# EAGLE design IntUltiMem_proto2 (EAGLE 7.7.0)
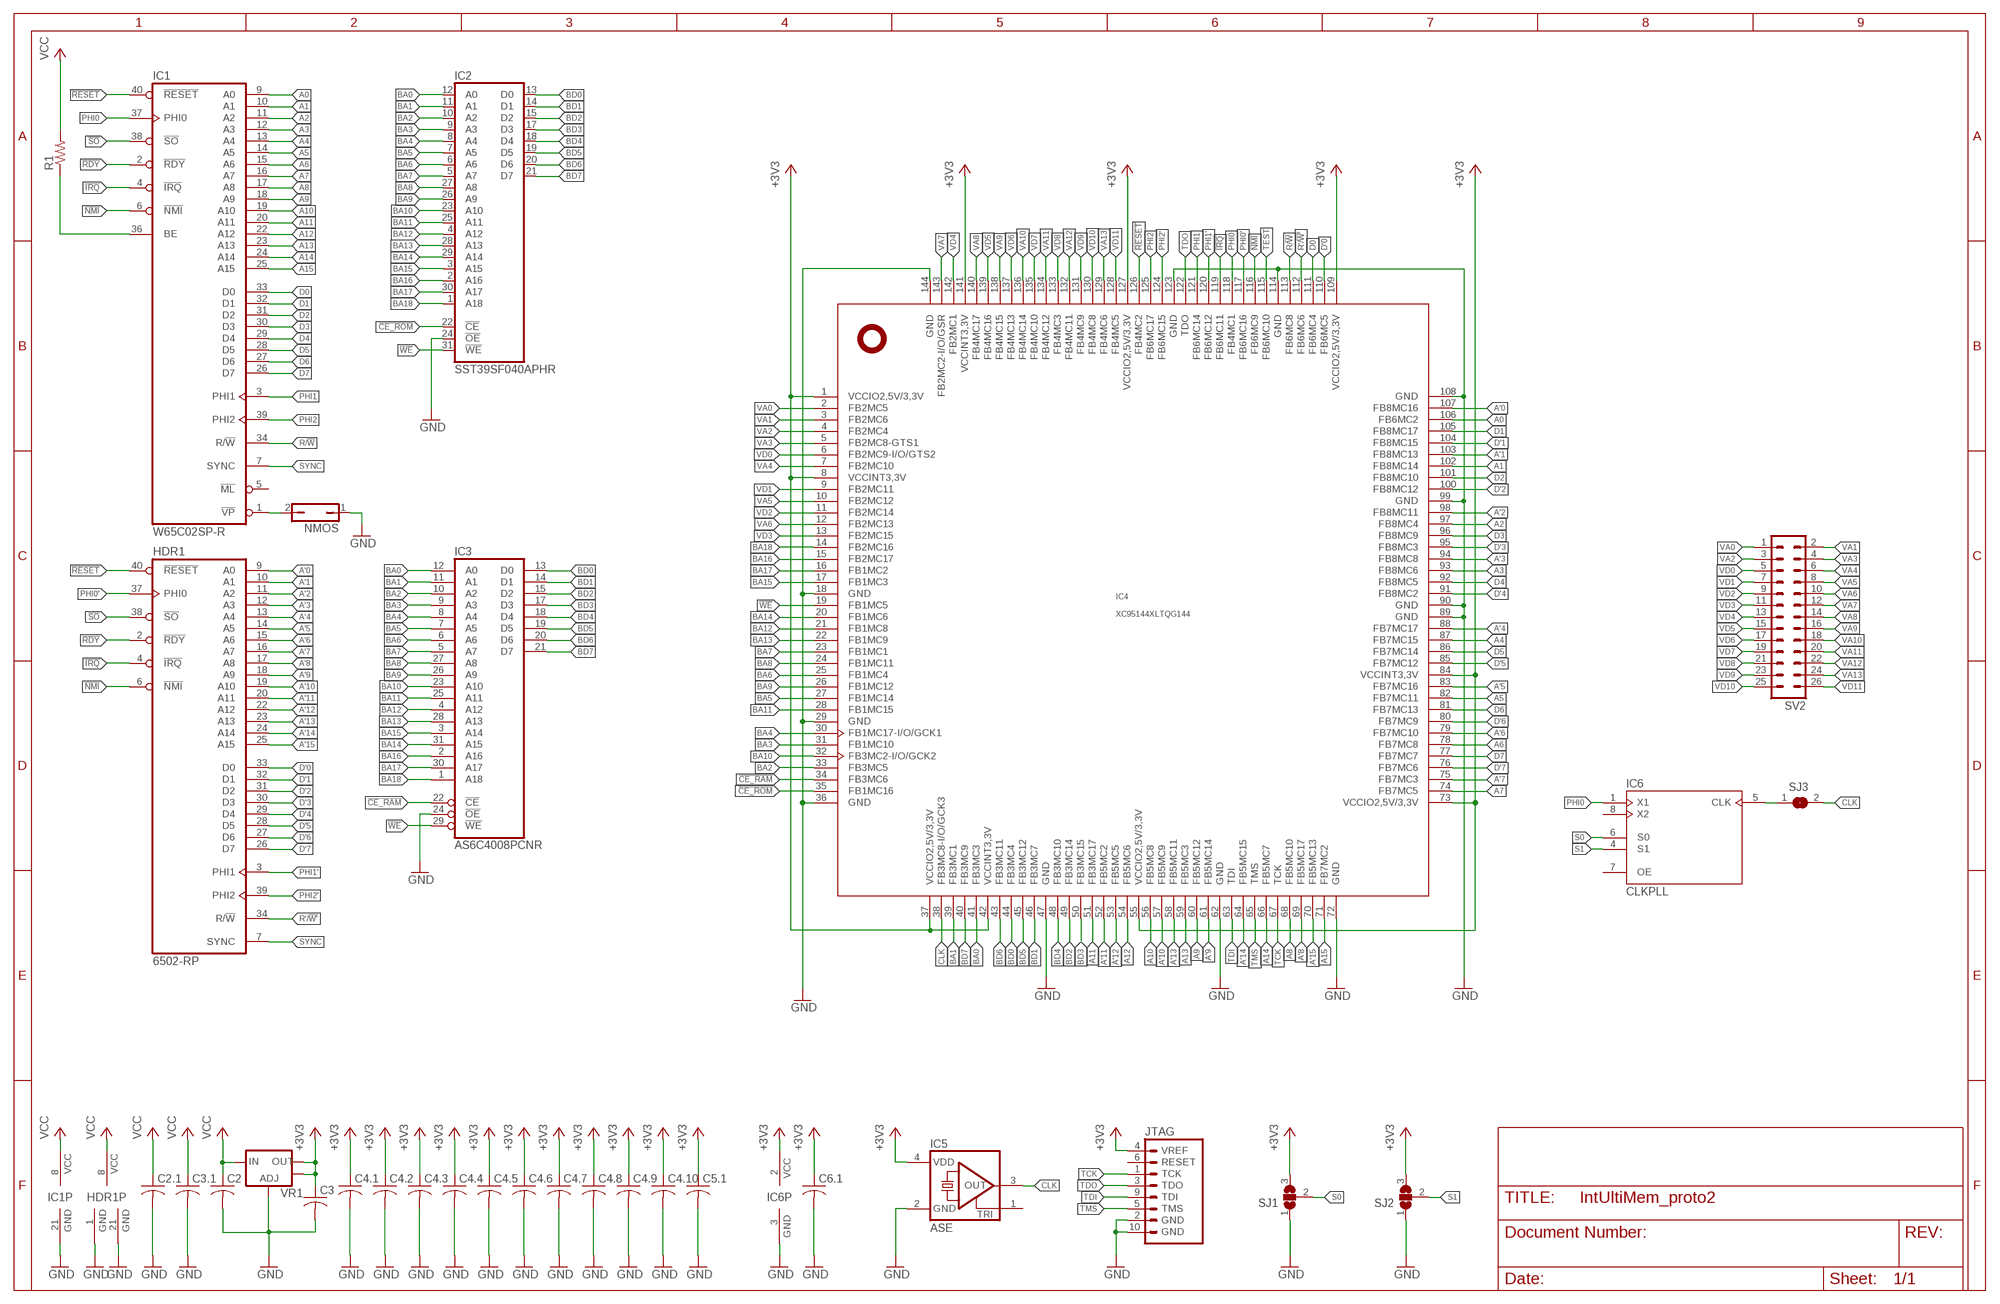
[diagram p0: schematic, sheet 1]

## Parts
C2  C-USC0805  [C0805]
C2.1  C-USC0402  [C0402]
C3  C-USC0805  [C0805]
C3.1  C-USC0402  [C0402]
C4.1  C-USC0402  [C0402]
C4.2  C-USC0402  [C0402]
C4.3  C-USC0402  [C0402]
C4.4  C-USC0402  [C0402]
C4.5  C-USC0402  [C0402]
C4.6  C-USC0402  [C0402]
C4.7  C-USC0402  [C0402]
C4.8  C-USC0402  [C0402]
C4.9  C-USC0402  [C0402]
C4.10  C-USC0402  [C0402]
C5.1  C-USC0402  [C0402]
C6.1  C-USC0402  [C0402]
HDR1  6502-RP  [DIL40-ROUNDPAD]
IC1  W65C02SP-R  [DIL40-ROUNDPAD]
IC2  SST39SF040APHR  [DIL32-RP]
IC3  AS6C4008PCNR  [DIL32-RP]
IC4  XC95144XLTQG144  [TQFP144]
IC5  ASE  [ASE]
IC6  CLKPLL  [SOIC8]
JTAG  JTAG  [JTAG]
NMOS  JP1Q  [JP1]
R1  R-US_R0402  [R0402]
SJ1  SJ2W  [SJ_2]
SJ2  SJ2W  [SJ_2]
SJ3  SJ  [SJ]
SV2  MA13-2  [MA13-2]
VR1  V_REG_LM1117SOT223  [SOT223]

## Nets
!CE_RAM: IC3.22(!CE) IC4.34(FB3MC6)
!CE_ROM: IC2.22(!CE) IC4.35(FB1MC16)
!IRQ: HDR1.4(!IRQ) IC1.4(!IRQ) IC4.119(FB6MC11)
!NMI: HDR1.6(!NMI) IC1.6(!NMI) IC4.116(FB6MC9)
!RDY: HDR1.2(!RDY) IC1.2(!RDY)
!RESET: HDR1.40(!RESET) IC1.40(!RESET) IC4.126(FB4MC2)
!SO: HDR1.38(!SO) IC1.38(!SO)
!WE: IC2.31(!WE) IC3.29(!WE) IC4.19(FB1MC5)
+3V3: C3.1 C4.1.1 C4.2.1 C4.3.1 C4.4.1 C4.5.1 C4.6.1 C4.7.1 C4.8.1 C4.9.1 C4.10.1 C5.1.1 C6.1.1 IC4.1(VCCIO2,5V/3,3V) IC4.8(VCCINT3,3V) IC4.37(VCCIO2,5V/3,3V) IC4.42(VCCINT3,3V) IC4.55(VCCIO2,5V/3,3V) IC4.73(VCCIO2,5V/3,3V) IC4.84(VCCINT3,3V) IC4.109(VCCIO2,5V/3,3V) IC4.127(VCCIO2,5V/3,3V) IC4.141(VCCINT3,3V) IC5.4(VDD) IC6.2(VCC) JTAG.4(VREF) SJ1.3 SJ2.3 VR1.2(OUT) VR1.4(OUT)
A0: IC1.9(A0) IC4.106(FB6MC2)
A1: IC1.10(A1) IC4.102(FB8MC14)
A2: IC1.11(A2) IC4.97(FB8MC4)
A3: IC1.12(A3) IC4.93(FB8MC6)
A4: IC1.13(A4) IC4.87(FB7MC15)
A5: IC1.14(A5) IC4.82(FB7MC11)
A6: IC1.15(A6) IC4.78(FB7MC8)
A7: IC1.16(A7) IC4.74(FB7MC5)
A8: IC1.17(A8) IC4.68(FB5MC10)
A9: IC1.18(A9) IC4.60(FB5MC12)
A10: IC1.19(A10) IC4.56(FB5MC8)
A11: IC1.20(A11) IC4.51(FB3MC17)
A12: IC1.22(A12) IC4.54(FB5MC6)
A13: IC1.23(A13) IC4.59(FB5MC3)
A14: IC1.24(A14) IC4.66(FB5MC7)
A15: IC1.25(A15) IC4.71(FB7MC2)
A'0: HDR1.9(A0) IC4.107(FB8MC16)
A'1: HDR1.10(A1) IC4.103(FB8MC13)
A'2: HDR1.11(A2) IC4.98(FB8MC11)
A'3: HDR1.12(A3) IC4.94(FB8MC8)
A'4: HDR1.13(A4) IC4.88(FB7MC17)
A'5: HDR1.14(A5) IC4.83(FB7MC16)
A'6: HDR1.15(A6) IC4.79(FB7MC10)
A'7: HDR1.16(A7) IC4.75(FB7MC3)
A'8: HDR1.17(A8) IC4.69(FB5MC17)
A'9: HDR1.18(A9) IC4.61(FB5MC14)
A'10: HDR1.19(A10) IC4.57(FB5MC9)
A'11: HDR1.20(A11) IC4.52(FB5MC2)
A'12: HDR1.22(A12) IC4.53(FB5MC5)
A'13: HDR1.23(A13) IC4.58(FB5MC11)
A'14: HDR1.24(A14) IC4.64(FB5MC15)
A'15: HDR1.25(A15) IC4.70(FB5MC13)
BA0: IC2.12(A0) IC3.12(A0) IC4.41(FB3MC3)
BA1: IC2.11(A1) IC3.11(A1) IC4.39(FB3MC1)
BA2: IC2.10(A2) IC3.10(A2) IC4.33(FB3MC5)
BA3: IC2.9(A3) IC3.9(A3) IC4.31(FB1MC10)
BA4: IC2.8(A4) IC3.8(A4) IC4.30(FB1MC17-I/O/GCK1)
BA5: IC2.7(A5) IC3.7(A5) IC4.27(FB1MC14)
BA6: IC2.6(A6) IC3.6(A6) IC4.25(FB1MC4)
BA7: IC2.5(A7) IC3.5(A7) IC4.23(FB1MC1)
BA8: IC2.27(A8) IC3.27(A8) IC4.24(FB1MC11)
BA9: IC2.26(A9) IC3.26(A9) IC4.26(FB1MC12)
BA10: IC2.23(A10) IC3.23(A10) IC4.32(FB3MC2-I/O/GCK2)
BA11: IC2.25(A11) IC3.25(A11) IC4.28(FB1MC15)
BA12: IC2.4(A12) IC3.4(A12) IC4.21(FB1MC8)
BA13: IC2.28(A13) IC3.28(A13) IC4.22(FB1MC9)
BA14: IC2.29(A14) IC3.31(A15) IC4.20(FB1MC6)
BA15: IC2.3(A15) IC3.3(A14) IC4.17(FB1MC3)
BA16: IC2.2(A16) IC3.2(A16) IC4.15(FB2MC17)
BA17: IC2.30(A17) IC3.30(A17) IC4.16(FB1MC2)
BA18: IC2.1(A18) IC3.1(A18) IC4.14(FB2MC16)
BD0: IC2.13(D0) IC3.13(D0) IC4.44(FB3MC4)
BD1: IC2.14(D1) IC3.14(D1) IC4.46(FB3MC7)
BD2: IC2.15(D2) IC3.15(D2) IC4.49(FB3MC14)
BD3: IC2.17(D3) IC3.17(D3) IC4.50(FB3MC15)
BD4: IC2.18(D4) IC3.18(D4) IC4.48(FB3MC10)
BD5: IC2.19(D5) IC3.19(D5) IC4.45(FB3MC12)
BD6: IC2.20(D6) IC3.20(D6) IC4.43(FB3MC11)
BD7: IC2.21(D7) IC3.21(D7) IC4.40(FB3MC9)
CLK: IC4.38(FB3MC8-I/O/GCK3) IC5.3(OUT) SJ3.2
D0: IC1.33(D0) IC4.111(FB6MC4)
D1: IC1.32(D1) IC4.105(FB8MC17)
D2: IC1.31(D2) IC4.101(FB8MC10)
D3: IC1.30(D3) IC4.96(FB8MC9)
D4: IC1.29(D4) IC4.92(FB8MC5)
D5: IC1.28(D5) IC4.86(FB7MC14)
D6: IC1.27(D6) IC4.81(FB7MC13)
D7: IC1.26(D7) IC4.77(FB7MC7)
D'0: HDR1.33(D0) IC4.110(FB6MC5)
D'1: HDR1.32(D1) IC4.104(FB8MC15)
D'2: HDR1.31(D2) IC4.100(FB8MC12)
D'3: HDR1.30(D3) IC4.95(FB8MC3)
D'4: HDR1.29(D4) IC4.91(FB8MC2)
D'5: HDR1.28(D5) IC4.85(FB7MC12)
D'6: HDR1.27(D6) IC4.80(FB7MC9)
D'7: HDR1.26(D7) IC4.76(FB7MC6)
GND: C2.1.2 C2.2 C3.1.2 C3.2 C4.1.2 C4.2.2 C4.3.2 C4.4.2 C4.5.2 C4.6.2 C4.7.2 C4.8.2 C4.9.2 C4.10.2 C5.1.2 C6.1.2 HDR1.1(GND) HDR1.21(GND) IC1.21(GND) IC2.24(!OE) IC3.24(!OE) IC4.18(GND) IC4.29(GND) IC4.36(GND) IC4.47(GND) IC4.62(GND) IC4.72(GND) IC4.89(GND) IC4.90(GND) IC4.99(GND) IC4.108(GND) IC4.114(GND) IC4.123(GND) IC4.144(GND) IC5.2(GND) IC6.3(GND) JTAG.2(GND) JTAG.10(GND) NMOS.1 SJ1.1 SJ2.1 VR1.1(ADJ)
N$1: IC1.36(BE) R1.1
N$3: IC1.1(!VP) NMOS.2
N$4: IC6.5(CLK) SJ3.1
PHI0: IC1.37(PHI0) IC4.118(FB4MC1) IC6.1(X1)
PHI0': HDR1.37(PHI0) IC4.117(FB6MC16)
PHI1: IC1.3(PHI1) IC4.121(FB6MC14)
PHI1': HDR1.3(PHI1) IC4.120(FB6MC12)
PHI2: IC1.39(PHI2) IC4.125(FB6MC17)
PHI2': HDR1.39(PHI2) IC4.124(FB6MC15)
R'/!W': HDR1.34(R/!W) IC4.112(FB6MC6)
R/!W: IC1.34(R/!W) IC4.113(FB6MC8)
S0: IC6.6(S0) SJ1.2
S1: IC6.4(S1) SJ2.2
SYNC: HDR1.7(SYNC) IC1.7(SYNC)
TCK: IC4.67(TCK) JTAG.1(TCK)
TDI: IC4.63(TDI) JTAG.9(TDI)
TDO: IC4.122(TDO) JTAG.3(TDO)
TEST: IC4.115(FB6MC10)
TMS: IC4.65(TMS) JTAG.5(TMS)
VA0: IC4.2(FB2MC5) SV2.1
VA1: IC4.3(FB2MC6) SV2.2
VA2: IC4.4(FB2MC4) SV2.3
VA3: IC4.5(FB2MC8-GTS1) SV2.4
VA4: IC4.7(FB2MC10) SV2.6
VA5: IC4.10(FB2MC12) SV2.8
VA6: IC4.12(FB2MC13) SV2.10
VA7: IC4.143(FB2MC2-I/O/GSR) SV2.12
VA8: IC4.140(FB4MC17) SV2.14
VA9: IC4.138(FB4MC15) SV2.16
VA10: IC4.136(FB4MC14) SV2.18
VA11: IC4.134(FB4MC12) SV2.20
VA12: IC4.132(FB4MC11) SV2.22
VA13: IC4.129(FB4MC6) SV2.24
VCC: C2.1 C2.1.1 C3.1.1 HDR1.8(VCC) IC1.8(VCC) R1.2 VR1.3(IN)
VD0: IC4.6(FB2MC9-I/O/GTS2) SV2.5
VD1: IC4.9(FB2MC11) SV2.7
VD2: IC4.11(FB2MC14) SV2.9
VD3: IC4.13(FB2MC15) SV2.11
VD4: IC4.142(FB2MC1) SV2.13
VD5: IC4.139(FB4MC16) SV2.15
VD6: IC4.137(FB4MC13) SV2.17
VD7: IC4.135(FB4MC10) SV2.19
VD8: IC4.133(FB4MC3) SV2.21
VD9: IC4.131(FB4MC9) SV2.23
VD10: IC4.130(FB4MC8) SV2.25
VD11: IC4.128(FB4MC5) SV2.26
Unconnected: IC1.5(!ML) IC5.1(TRI) IC6.7(OE) IC6.8(X2) JTAG.6(RESET)

## Power pins joined to a net without a drawn wire
GND: IC2.16(GND) IC3.16(GND)
VCC: IC2.32(VCC) IC3.32(VCC)

## Library data of the parts
C2 C2.1 C3 C3.1 C4.1-C4.10 C5.1 C6.1 = rcl:C-US: CAPACITOR, American symbol
HDR1 = commodore:65*02: 6502 processor
IC1 = commodore:W65C02SP: Western Digital Version
IC2 = memory-sst:SST39SF040A: 4 Mbit x8 Multi-Purpose Flash Source: http://www.sst.com/dotAsset/40782.pdf
IC3 = memory-alliance:AS6C4008
IC4 = xilinx_xc95XXXxl:XC95144XLTQG144
IC5 = crystal:ASE: 3.3Vdc CMOS SMD CRYSTAL CLOCK OSCILLATOR SOurce: www.abracon.com; OC_FARNELL: unknown; OC_NEWARK: unknown
IC6 = pll-jlb:CLKPLL
JTAG = xilinx_xc95XXXxl:JTAG: PIN HEADER; OC_FARNELL: unknown; OC_NEWARK: unknown
NMOS = jumper-jlb:JP1Q: JUMPER
R1 = resistor:R-US_: RESISTOR, American symbol
SJ1 SJ2 = jumper:SJ2W: SMD solder JUMPER
SJ3 = jumper-jlb:SJ: SMD solder JUMPER
SV2 = con-lstb-rp:MA13-2: PIN HEADER; OC_FARNELL: unknown; OC_NEWARK: unknown
VR1 = SparkFun:V_REG_LM1117: Voltage Regulator LM1117 Standard adjustable voltage regulator but in SMD form. Spark Fun Electronics SKU : COM-00595

## Board
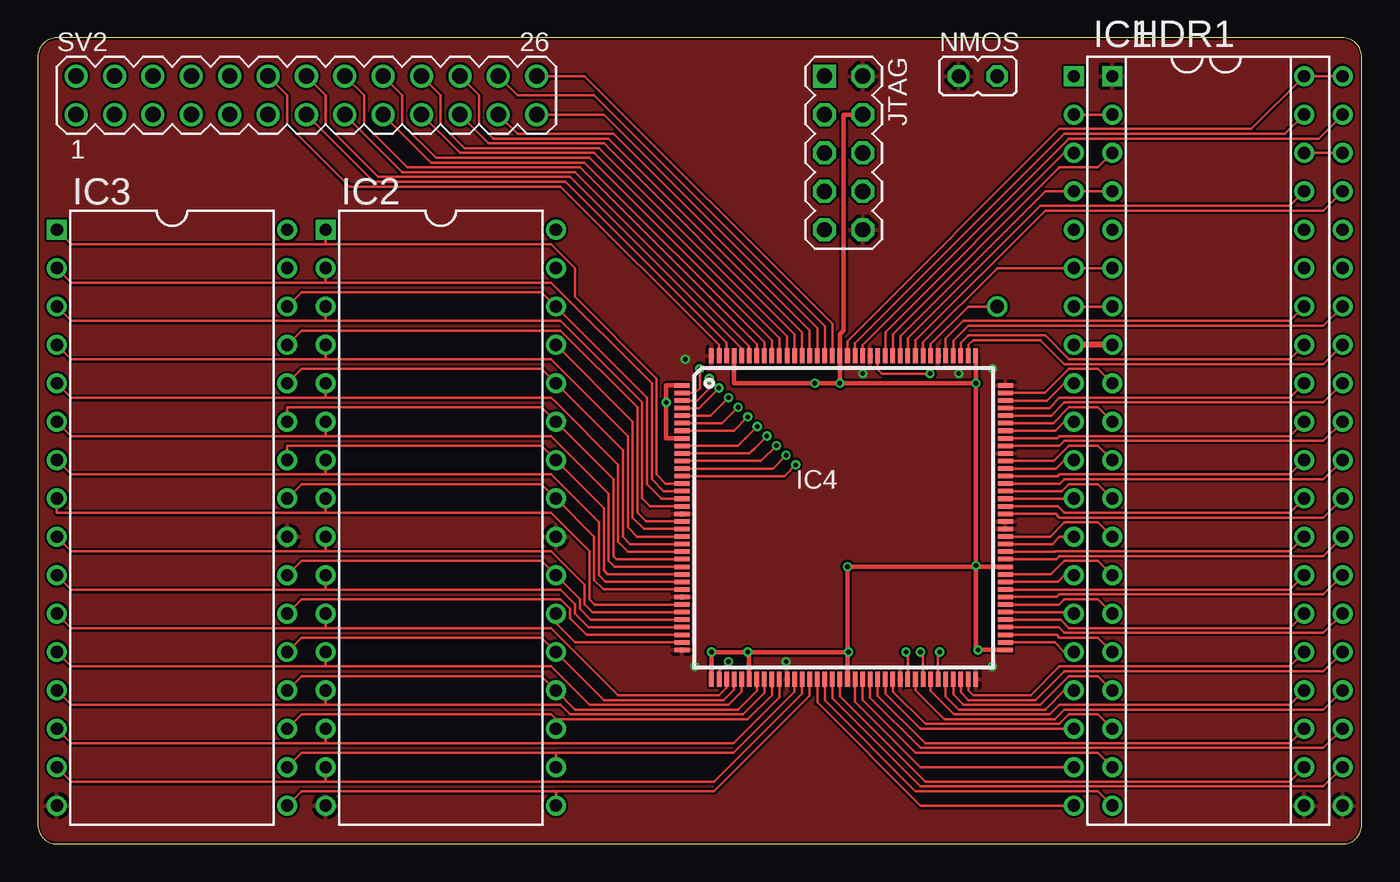
[diagram p1: board, top side]
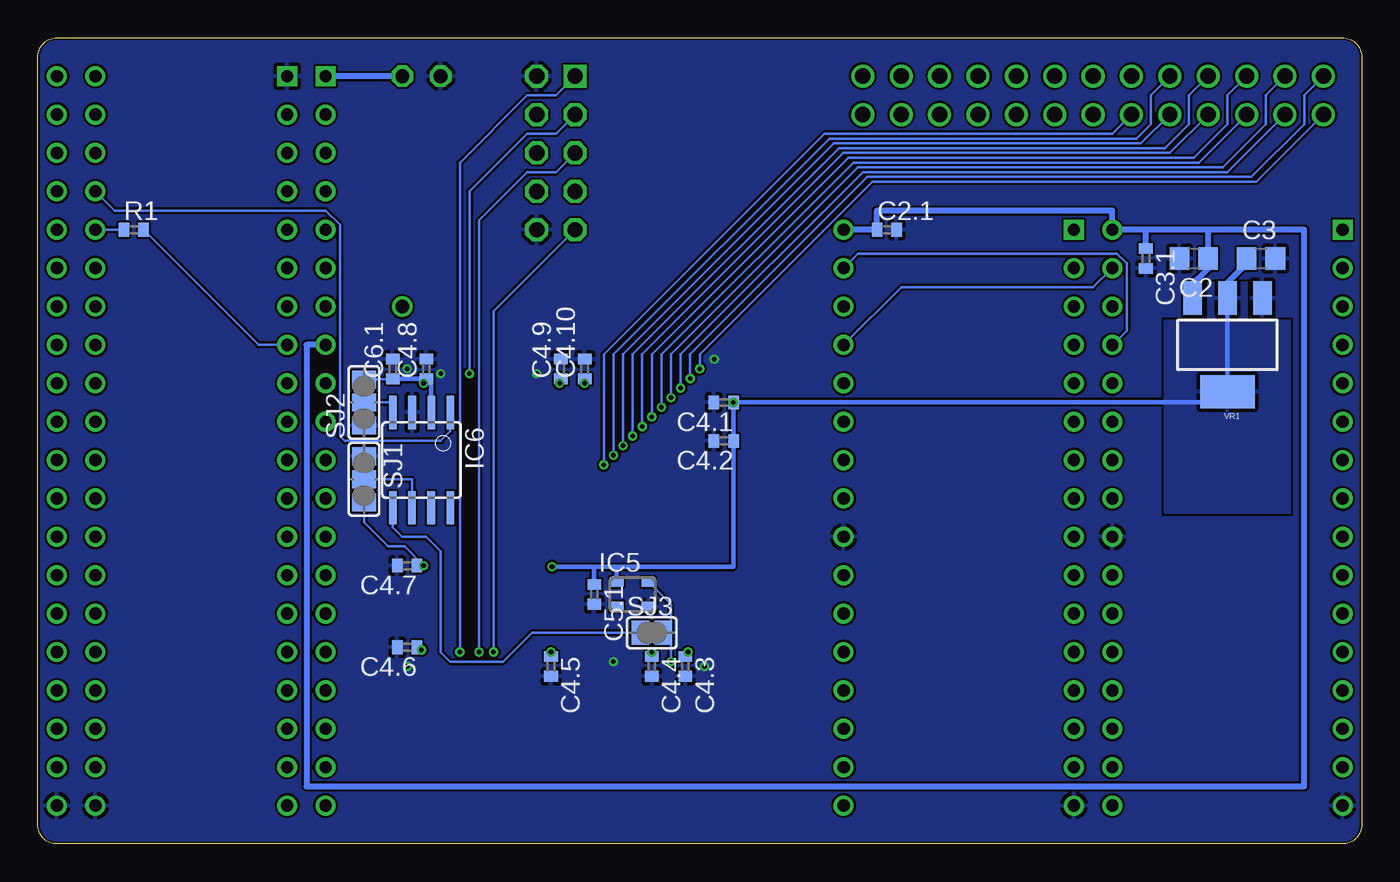
[diagram p2: board, bottom side, seen from below]

Size 87.63 x 53.34 mm. Coordinates in mm from the lower left corner, seen from the top.
Outline: 0,52.07 0,1.27 arc90 1.27,0 86.36,0 arc90 87.63,1.27 87.63,52.07 arc90 86.36,53.34 1.27,53.34 arc90 0,52.07
Copper layers (1*16): Top 0.035mm / dielectric 1.5mm / Bottom 0.035mm
Design rules "hackvana *": minimum track width 6mil, minimum drill 0.3mm, track to track 6mil, track to pad 6mil, pad to pad 6mil, via to via 6mil, smd to smd 0mil, copper to edge 6mil, drill to drill 6mil, minimum pad ring 10mil, minimum via ring 6mil, stop-mask expansion 2mil, vias tented up to drill 100mil, thermal gap 10mil

### Footprints (pad centres in the part's own frame; a part is rotated, then mirrored left to right if it is on the bottom)
C0805 = smd 1.3 x 1.5: 1 -0.95,0; 2 0.95,0
C0402 = smd 0.7 x 0.9: 1 -0.65,0; 2 0.65,0
DIL40-ROUNDPAD = drill 0.813 square: 1 -24.13,-7.62 | drill 0.813: 2 -21.59,-7.62; 3 -19.05,-7.62; 4 -16.51,-7.62; 5 -13.97,-7.62; 6 -11.43,-7.62; 7 -8.89,-7.62; 8 -6.35,-7.62; 9 -3.81,-7.62; 10 -1.27,-7.62; 11 1.27,-7.62; 12 3.81,-7.62; 13 6.35,-7.62; 14 8.89,-7.62; 15 11.43,-7.62; 16 13.97,-7.62; 17 16.51,-7.62; 18 19.05,-7.62; 19 21.59,-7.62; 20 24.13,-7.62; 21 24.13,7.62; 22 21.59,7.62; 23 19.05,7.62; 24 16.51,7.62; 25 13.97,7.62; 26 11.43,7.62; 27 8.89,7.62; 28 6.35,7.62; 29 3.81,7.62; 30 1.27,7.62; 31 -1.27,7.62; 32 -3.81,7.62; 33 -6.35,7.62; 34 -8.89,7.62; 35 -11.43,7.62; 36 -13.97,7.62; 37 -16.51,7.62; 38 -19.05,7.62; 39 -21.59,7.62; 40 -24.13,7.62
DIL32-RP = drill 0.813 square: 1 -19.05,-7.62 | drill 0.813: 2 -16.51,-7.62; 3 -13.97,-7.62; 4 -11.43,-7.62; 5 -8.89,-7.62; 6 -6.35,-7.62; 7 -3.81,-7.62; 8 -1.27,-7.62; 9 1.27,-7.62; 10 3.81,-7.62; 11 6.35,-7.62; 12 8.89,-7.62; 13 11.43,-7.62; 14 13.97,-7.62; 15 16.51,-7.62; 16 19.05,-7.62; 17 19.05,7.62; 18 16.51,7.62; 19 13.97,7.62; 20 11.43,7.62; 21 8.89,7.62; 22 6.35,7.62; 23 3.81,7.62; 24 1.27,7.62; 25 -1.27,7.62; 26 -3.81,7.62; 27 -6.35,7.62; 28 -8.89,7.62; 29 -11.43,7.62; 30 -13.97,7.62; 31 -16.51,7.62; 32 -19.05,7.62
TQFP144 = smd 1 x 0.3: 1 -10.7,8.75; 2 -10.7,8.25; 3 -10.7,7.75; 4 -10.7,7.25; 5 -10.7,6.75; 6 -10.7,6.25; 7 -10.7,5.75; 8 -10.7,5.25; 9 -10.7,4.75; 10 -10.7,4.25; 11 -10.7,3.75; 12 -10.7,3.25; 13 -10.7,2.75; 14 -10.7,2.25; 15 -10.7,1.75; 16 -10.7,1.25; 17 -10.7,0.75; 18 -10.7,0.25; 19 -10.7,-0.25; 20 -10.7,-0.75; 21 -10.7,-1.25; 22 -10.7,-1.75; 23 -10.7,-2.25; 24 -10.7,-2.75; 25 -10.7,-3.25; 26 -10.7,-3.75; 27 -10.7,-4.25; 28 -10.7,-4.75; 29 -10.7,-5.25; 30 -10.7,-5.75; 31 -10.7,-6.25; 32 -10.7,-6.75; 33 -10.7,-7.25; 34 -10.7,-7.75; 35 -10.7,-8.25; 36 -10.7,-8.75; 73 10.7,-8.75; 74 10.7,-8.25; 75 10.7,-7.75; 76 10.7,-7.25; 77 10.7,-6.75; 78 10.7,-6.25; 79 10.7,-5.75; 80 10.7,-5.25; 81 10.7,-4.75; 82 10.7,-4.25; 83 10.7,-3.75; 84 10.7,-3.25; 85 10.7,-2.75; 86 10.7,-2.25; 87 10.7,-1.75; 88 10.7,-1.25; 89 10.7,-0.75; 90 10.7,-0.25; 91 10.7,0.25; 92 10.7,0.75; 93 10.7,1.25; 94 10.7,1.75; 95 10.7,2.25; 96 10.7,2.75; 97 10.7,3.25; 98 10.7,3.75; 99 10.7,4.25; 100 10.7,4.75; 101 10.7,5.25; 102 10.7,5.75; 103 10.7,6.25; 104 10.7,6.75; 105 10.7,7.25; 106 10.7,7.75; 107 10.7,8.25; 108 10.7,8.75 | smd 0.3 x 1: 37 -8.75,-10.7; 38 -8.25,-10.7; 39 -7.75,-10.7; 40 -7.25,-10.7; 41 -6.75,-10.7; 42 -6.25,-10.7; 43 -5.75,-10.7; 44 -5.25,-10.7; 45 -4.75,-10.7; 46 -4.25,-10.7; 47 -3.75,-10.7; 48 -3.25,-10.7; 49 -2.75,-10.7; 50 -2.25,-10.7; 51 -1.75,-10.7; 52 -1.25,-10.7; 53 -0.75,-10.7; 54 -0.25,-10.7; 55 0.25,-10.7; 56 0.75,-10.7; 57 1.25,-10.7; 58 1.75,-10.7; 59 2.25,-10.7; 60 2.75,-10.7; 61 3.25,-10.7; 62 3.75,-10.7; 63 4.25,-10.7; 64 4.75,-10.7; 65 5.25,-10.7; 66 5.75,-10.7; 67 6.25,-10.7; 68 6.75,-10.7; 69 7.25,-10.7; 70 7.75,-10.7; 71 8.25,-10.7; 72 8.75,-10.7; 109 8.75,10.7; 110 8.25,10.7; 111 7.75,10.7; 112 7.25,10.7; 113 6.75,10.7; 114 6.25,10.7; 115 5.75,10.7; 116 5.25,10.7; 117 4.75,10.7; 118 4.25,10.7; 119 3.75,10.7; 120 3.25,10.7; 121 2.75,10.7; 122 2.25,10.7; 123 1.75,10.7; 124 1.25,10.7; 125 0.75,10.7; 126 0.25,10.7; 127 -0.25,10.7; 128 -0.75,10.7; 129 -1.25,10.7; 130 -1.75,10.7; 131 -2.25,10.7; 132 -2.75,10.7; 133 -3.25,10.7; 134 -3.75,10.7; 135 -4.25,10.7; 136 -4.75,10.7; 137 -5.25,10.7; 138 -5.75,10.7; 139 -6.25,10.7; 140 -6.75,10.7; 141 -7.25,10.7; 142 -7.75,10.7; 143 -8.25,10.7; 144 -8.75,10.7
ASE = smd 0.9 x 0.65: 1 -1.05,-0.825; 2 1.05,-0.825; 3 1.05,0.825; 4 -1.05,0.825
SOIC8 = smd 0.5 x 2.2: 1 -1.905,-3.154; 2 -0.645,-3.154; 3 0.625,-3.154; 4 1.895,-3.154; 5 1.905,3.154; 6 0.635,3.154; 7 -0.635,3.154; 8 -1.905,3.154
JTAG = drill 1.016 square: 1 -5.08,-1.27 | drill 1.016 octagon: 2 -5.08,1.27; 3 -2.54,-1.27; 4 -2.54,1.27; 5 0,-1.27; 6 0,1.27; 7 2.54,-1.27; 8 2.54,1.27; 9 5.08,-1.27; 10 5.08,1.27
JP1 = drill 0.914 octagon: 1 0,-1.27; 2 0,1.27
R0402 = smd 0.7 x 0.9: 1 -0.65,0; 2 0.65,0
SJ_2 = smd 1.168 x 1.6: 1 -1.524,0; 2 0,0; 3 1.524,0
SJ = smd 1.168 x 1.6: 1 -0.762,0; 2 0.762,0
MA13-2 = drill 1.016: 1 -15.24,-1.27; 2 -15.24,1.27; 3 -12.7,-1.27; 4 -12.7,1.27; 5 -10.16,-1.27; 6 -10.16,1.27; 7 -7.62,-1.27; 8 -7.62,1.27; 9 -5.08,-1.27; 10 -5.08,1.27; 11 -2.54,-1.27; 12 -2.54,1.27; 13 0,-1.27; 14 0,1.27; 15 2.54,-1.27; 16 2.54,1.27; 17 5.08,-1.27; 18 5.08,1.27; 19 7.62,-1.27; 20 7.62,1.27; 21 10.16,-1.27; 22 10.16,1.27; 23 12.7,-1.27; 24 12.7,1.27; 25 15.24,-1.27; 26 15.24,1.27
SOT223 = smd 1.219 x 2.235: 1 -2.311,-3.099; 2 0,-3.099; 3 2.311,-3.099 | smd 3.6 x 2.2: 4 0,3.099

### Placement (x,y rotation side)
C2  11.11,38.74 180 bottom
C2.1  31.43,40.64 0 bottom
C3  6.67,38.74 0 bottom
C3.1  14.29,38.74 270 bottom
C4.1  42.23,29.21 180 bottom
C4.2  42.23,26.67 180 bottom
C4.3  44.77,11.75 270 bottom
C4.4  46.99,11.75 270 bottom
C4.5  53.66,11.75 270 bottom
C4.6  63.18,13.02 180 bottom
C4.7  63.18,18.41 180 bottom
C4.8  61.91,31.43 90 bottom
C4.9  53.02,31.43 90 bottom
C4.10  51.44,31.43 90 bottom
C5.1  50.8,16.51 270 bottom
C6.1  64.14,31.43 90 bottom
HDR1  78.74,26.67 270 top
IC1  76.2,26.67 270 top
IC2  26.67,21.59 270 top
IC3  8.89,21.59 270 top
IC4  53.34,21.59 0 top
IC5  48.26,16.51 0 bottom
IC6  62.23,25.4 180 bottom
JTAG  53.34,45.72 270 top
NMOS  62.23,50.8 270 top
R1  81.28,40.64 0 bottom
SJ1  66.04,24.13 270 bottom
SJ2  66.04,29.21 90 bottom
SJ3  46.99,13.97 0 bottom
SV2  17.78,49.53 0 top
VR1  8.89,33.02 180 bottom

### Tracks (layer width: path | path; a pad name or v marks a point on that pad's centre or on a via)
!CE_RAM
  Top 0.152: IC3.22 17.46,16.19 34.61,16.19 35.24,15.56 35.24,14.92 36.33,13.84 IC4.34
!CE_ROM
  Top 0.152: IC4.35 35.55,13.34 34.29,14.61 IC2.22
!IRQ
  Top 0.152: HDR1.4 IC1.4 66.67,43.18 57.09,33.6 IC4.119
!NMI
  Top 0.152: HDR1.6 IC1.6 63.5,38.1 58.59,33.19 IC4.116
!RDY
  Top 0.152: IC1.2 HDR1.2
!RESET
  Top 0.152: IC4.126 53.59,33.27 67.63,47.31 80.33,47.31 IC1.40 HDR1.40
!SO
  Top 0.152: IC1.38 HDR1.38
!WE
  Top 0.152: IC3.29 17.46,33.97 34.61,33.97 39.69,28.89 39.69,21.91 40.26,21.34 IC4.19
  Bottom 0.152: IC2.31 33.34,39.05 16.19,39.05 15.56,38.42 15.56,33.97 IC3.29
+3V3  (via drill 0.3)
  Top 0.305: JTAG.4 53.34,48.26 53.34,33.97 53.09,33.72 IC4.127 v53.09,30.48 | IC4.141 46.09,30.48 v51.44,30.48 v53.09,30.48 | IC4.109 v62.09,30.48 | v62.09,30.48 v53.09,30.48 | IC4.84 62.09,18.34 | v62.09,30.48 v62.09,18.41 62.09,18.34 | 62.09,18.34 v53.59,18.34 53.59,12.7 | IC4.8 41.59,26.84 v41.59,29.21 41.59,30.34 IC4.1 | IC4.55 53.59,12.7 | IC4.42 47.09,12.7 | 47.09,12.7 v53.66,12.7 53.59,12.7 | IC4.73 v62.23,12.84 | v62.23,12.84 62.09,12.84 62.09,12.98 | 62.09,12.98 62.09,18.34 | IC4.37 v44.59,12.7 v46.99,12.7 47.09,12.7 | v62.23,12.84 arc-90 62.09,12.98
  Bottom 0.152: SJ1.3 66.04,21.27 64.45,19.68 63.36,19.68 v62.09,18.41 | SJ2.3 62.09,30.73 v62.09,30.48
  Bottom 0.305: VR1.2 VR1.4 8.89,29.21 C4.1.1 v41.59,29.21 41.59,26.67 | v53.59,18.34 50.8,18.34 | 50.8,18.34 49.53,18.34 | 49.53,18.34 41.59,18.34 41.59,26.67 | IC5.4 49.31,18.12 49.53,18.34 | C4.6.1 62.41,13.02 v62.23,12.84 | C4.7.1 v62.09,18.41 | C4.8.1 62.09,30.78 v62.09,30.48 | C4.10.1 v51.44,30.48 | C4.9.1 53.09,30.78 v53.09,30.48 | C4.5.1 v53.66,12.7 | C4.4.1 v46.99,12.7 | C4.3.1 44.77,12.7 v44.59,12.7 | C4.2.1 41.59,26.67 | C5.1.1 50.8,18.34 | v62.09,30.48 61.59,30.48 IC6.2 | C6.1.1 62.39,30.78 v62.09,30.48
  Bottom 0.406: C3.1 7.62,38.42 8.89,37.15 VR1.2
  pour Bottom: 7.62,37.15 7.62,34.61 4.76,34.61 4.76,21.91 13.02,21.91 13.02,34.61 10.16,34.61 10.16,37.15
A0
  Top 0.152: IC1.9 67.94,30.48 66.81,29.34 IC4.106
A1
  Top 0.152: IC1.10 67.94,27.94 67.34,27.34 IC4.102
A2
  Top 0.152: IC1.11 67.94,25.4 67.39,24.84 IC4.97
A3
  Top 0.152: IC1.12 67.94,22.86 67.92,22.84 IC4.93
A4
  Top 0.152: IC4.87 67.15,19.84 67.63,20.32 IC1.13
A5
  Top 0.152: IC4.82 67.5,17.34 67.94,17.78 IC1.14
A6
  Top 0.152: IC1.15 67.94,15.24 67.84,15.34 IC4.78
A7
  Top 0.152: IC1.16 67.94,12.7 67.31,13.34 IC4.74
A8
  Top 0.152: IC4.68 60.09,9.76 60.96,8.89 66.67,8.89 67.94,10.16 IC1.17
A9
  Top 0.152: IC4.60 56.09,9.95 58.42,7.62 IC1.18
A10
  Top 0.152: IC4.56 54.09,9.41 58.42,5.08 IC1.19
A11
  Top 0.152: IC1.20 58.42,2.54 51.59,9.37 IC4.51
A12
  Top 0.152: IC1.22 82.87,4.13 58.74,4.13 53.09,9.78 IC4.54
A13
  Top 0.152: IC1.23 82.87,6.67 58.74,6.67 55.59,9.81 IC4.59
A14
  Top 0.152: IC1.24 82.87,9.21 67.63,9.21 66.99,8.57 60.64,8.57 59.09,10.12 IC4.66
A15
  Top 0.152: IC1.25 82.87,11.75 67.63,11.75 65.72,9.84 61.91,9.84 61.59,10.16 IC4.71
A'0
  Top 0.152: HDR1.9 70.17,31.43 68.26,31.43 66.67,29.84 IC4.107
A'1
  Top 0.152: HDR1.10 70.17,28.89 68.26,28.89 67.21,27.84 IC4.103
A'2
  Top 0.152: HDR1.11 70.17,26.35 68.26,26.35 67.25,25.34 IC4.98
A'3
  Top 0.152: HDR1.12 70.17,23.81 68.26,23.81 67.79,23.34 IC4.94
A'4
  Top 0.152: HDR1.13 70.17,21.27 67.94,21.27 67.01,20.34 IC4.88
A'5
  Top 0.152: HDR1.14 70.17,18.73 67.94,18.73 67.05,17.84 IC4.83
A'6
  Top 0.152: HDR1.15 70.17,16.19 67.94,16.19 67.59,15.84 IC4.79
A'7
  Top 0.152: HDR1.16 70.17,13.65 67.63,13.65 67.44,13.84 IC4.75
A'8
  Top 0.152: HDR1.17 70.17,11.11 68.26,11.11 66.36,9.21 61.28,9.21 60.59,9.89 IC4.69
A'9
  Top 0.152: HDR1.18 70.17,8.57 68.26,8.57 67.63,7.94 58.74,7.94 56.59,10.08 IC4.61
A'10
  Top 0.152: HDR1.19 70.17,6.03 68.26,6.03 67.94,6.03 58.1,6.03 54.59,9.54 IC4.57
A'11
  Top 0.152: HDR1.20 70.17,3.49 58.1,3.49 52.09,9.5 IC4.52
A'12
  Top 0.152: HDR1.22 85.09,3.81 58.42,3.81 52.59,9.64 IC4.53
A'13
  Top 0.152: HDR1.23 85.09,6.35 58.42,6.35 55.09,9.68 IC4.58
A'14
  Top 0.152: HDR1.24 85.09,8.89 67.94,8.89 67.31,8.26 60.01,8.26 58.09,10.17 IC4.64
A'15
  Top 0.152: HDR1.25 85.09,11.43 67.94,11.43 66.04,9.53 61.59,9.53 61.09,10.03 IC4.70
BA0
  Top 0.152: 19.05,11.75 2.22,11.75 IC3.12 | 19.05,11.75 33.97,11.75 36.51,9.21 45.72,9.21 46.59,10.08 IC4.41 | IC2.12 19.05,11.75
BA1
  Top 0.152: 19.05,14.29 2.22,14.29 IC3.11 | 19.05,14.29 33.97,14.29 38.42,9.84 45.09,9.84 45.59,10.35 IC4.39 | IC2.11 19.05,14.29
BA2
  Top 0.152: 19.05,16.83 2.22,16.83 IC3.10 | 19.05,16.83 34.61,16.83 35.56,15.88 35.56,15.24 36.46,14.34 IC4.33 | IC2.10 19.05,16.83
BA3
  Top 0.152: 19.05,19.37 2.22,19.37 IC3.9 | 19.05,19.37 33.97,19.37 36.2,17.14 36.2,15.88 36.73,15.34 IC4.31 | IC2.9 19.05,19.37
BA4
  Top 0.152: 19.05,21.91 1.27,21.91 IC3.8 | 19.05,21.91 33.97,21.91 36.51,19.37 36.51,16.19 36.87,15.84 IC4.30 | IC2.8 19.05,21.91
BA5
  Top 0.152: 19.05,24.45 2.22,24.45 IC3.7 | 19.05,24.45 33.97,24.45 37.15,21.27 37.15,17.78 37.59,17.34 IC4.27 | IC2.7 19.05,24.45
BA6
  Top 0.152: 19.05,26.99 2.22,26.99 IC3.6 | 19.05,26.99 33.97,26.99 37.78,23.18 37.78,18.73 38.17,18.34 IC4.25 | IC2.6 19.05,26.99
BA7
  Top 0.152: 19.05,29.53 2.22,29.53 IC3.5 | 19.05,29.53 33.97,29.53 34.29,29.21 38.42,25.08 38.42,20 39.08,19.34 IC4.23 | IC2.5 19.05,29.53
BA8
  Top 0.152: IC3.27 16.51,28.89 33.34,28.89 IC2.27 38.1,24.13 38.1,19.05 38.31,18.84 IC4.24
BA9
  Top 0.152: IC3.26 16.51,26.35 33.34,26.35 IC2.26 37.47,22.22 37.47,18.1 37.72,17.84 IC4.26
BA10
  Top 0.152: IC3.23 17.46,18.73 33.34,18.73 IC2.23 35.88,16.19 35.88,15.56 36.59,14.84 IC4.32
BA11
  Top 0.152: IC3.25 17.46,23.81 33.34,23.81 IC2.25 36.83,20.32 36.83,17.46 37.45,16.84 IC4.28
BA12
  Top 0.152: IC3.4 2.22,32.07 19.05,32.07 | 19.05,32.07 33.97,32.07 39.05,26.99 39.05,20.95 39.67,20.34 IC4.21 | IC2.4 19.05,32.07
BA13
  Top 0.152: IC3.28 17.46,31.43 33.34,31.43 IC2.28 38.73,26.04 38.73,20.32 39.22,19.84 IC4.22
BA14
  Top 0.152: IC4.20 40.12,20.84 39.37,21.59 39.37,27.94 IC2.29
  Bottom 0.152: IC3.31 17.78,36.83 30.48,36.83 IC2.29
BA15
  Top 0.152: IC3.3 2.22,34.61 19.05,34.61 | 19.05,34.61 34.61,34.61 40.01,29.21 40.01,22.86 40.53,22.34 IC4.17 | IC2.3 19.05,34.61
BA16
  Top 0.152: IC3.2 2.22,37.15 19.05,37.15 | 19.05,37.15 33.97,37.15 40.64,30.48 40.64,24.13 41.43,23.34 IC4.15 | IC2.2 19.05,37.15
BA17
  Top 0.152: IC3.30 17.46,36.51 33.34,36.51 IC2.30 40.32,29.53 40.32,23.81 41.3,22.84 IC4.16
BA18
  Top 0.152: IC3.1 2.22,39.69 19.05,39.69 | 19.05,39.69 IC2.1 | 19.05,39.69 33.97,39.69 35.56,38.1 35.56,36.2 40.96,30.79 40.96,24.45 41.56,23.84 IC4.14
BD0
  Top 0.152: IC3.13 2.22,9.21 19.05,9.21 | 19.05,9.21 34.61,9.21 35.24,8.57 46.67,8.57 48.09,9.99 IC4.44 | IC2.13 19.05,9.21
BD1
  Top 0.152: IC3.14 2.22,6.67 19.05,6.67 | 19.05,6.67 46.04,6.67 49.09,9.72 IC4.46 | IC2.14 19.05,6.67
BD2
  Top 0.152: IC3.15 2.22,4.13 19.05,4.13 | 19.05,4.13 44.77,4.13 50.59,9.95 IC4.49 | IC2.15 19.05,4.13
BD3
  Top 0.152: IC3.17 17.46,3.49 34.29,3.49 | 34.29,3.49 IC2.17 | IC4.50 51.09,9.81 44.77,3.49 34.29,3.49
BD4
  Top 0.152: IC3.18 17.46,6.03 34.29,6.03 | IC2.18 34.29,6.03 | IC4.48 50.09,10.08 46.04,6.03 34.29,6.03
BD5
  Top 0.152: IC3.19 17.46,8.57 33.97,8.57 34.29,8.26 | 34.29,8.26 IC2.19 | 34.29,8.26 46.99,8.26 48.59,9.86 IC4.45
BD6
  Top 0.152: IC3.20 17.46,11.11 33.34,11.11 IC2.20 35.56,8.89 46.36,8.89 47.59,10.12 IC4.43
BD7
  Top 0.152: IC3.21 17.46,13.65 33.34,13.65 IC2.21 37.47,9.53 45.4,9.53 46.09,10.21 IC4.40
CLK  (via drill 0.3)
  Top 0.152: IC4.38 45.09,11.43 v45.72,12.06
  Bottom 0.152: v45.72,12.06 45.72,13.97 | 45.72,13.97 45.72,15.84 IC5.3 | SJ3.2 45.72,13.97
D0
  Top 0.152: IC1.33 82.87,32.07 68.26,32.07 66.67,33.66 61.59,33.66 61.09,33.15 IC4.111
D1
  Top 0.152: IC1.32 82.87,29.53 67.63,29.53 66.94,28.84 IC4.105
D2
  Top 0.152: IC1.31 82.87,26.99 67.63,26.99 67.48,26.84 IC4.101
D3
  Top 0.152: IC1.30 82.87,24.45 67.63,24.45 67.52,24.34 IC4.96
D4
  Top 0.152: IC1.29 82.87,21.91 67.94,21.91 67.51,22.34 IC4.92
D5
  Top 0.152: IC1.28 82.87,19.37 67.31,19.37 67.28,19.34 IC4.86
D6
  Top 0.152: IC1.27 82.87,16.83 64.05,16.83 IC4.81
D7
  Top 0.152: IC1.26 82.87,14.29 68.26,14.29 67.71,14.84 IC4.77
D'0
  Top 0.152: HDR1.33 85.09,31.75 67.94,31.75 66.36,33.34 61.91,33.34 61.59,33.02 IC4.110
D'1
  Top 0.152: HDR1.32 85.09,29.21 67.94,29.21 67.08,28.34 IC4.104
D'2
  Top 0.152: HDR1.31 85.09,26.67 67.94,26.67 67.61,26.34 IC4.100
D'3
  Top 0.152: HDR1.30 85.09,24.13 67.94,24.13 67.66,23.84 IC4.95
D'4
  Top 0.152: HDR1.29 85.09,21.59 67.63,21.59 67.38,21.84 IC4.91
D'5
  Top 0.152: HDR1.28 85.09,19.05 67.63,19.05 67.42,18.84 IC4.85
D'6
  Top 0.152: HDR1.27 85.09,16.51 67.63,16.51 67.46,16.34 IC4.80
D'7
  Top 0.152: HDR1.26 85.09,13.97 67.94,13.97 67.58,14.34 IC4.76
GND  (via drill 0.3)
  other vias: 49.53,12.06 63.18,11.75 43.5,11.75 42.86,32.07 63.18,31.43 54.61,31.11 60.96,31.11
  pour Bottom (rank 2): 87.63,52.07 87.63,1.27 arc-90 86.36,0 1.27,0 arc-90 0,1.27 0,52.07 arc-90 1.27,53.34 86.36,53.34 arc-90
  pour Top (rank 2): 87.63,52.07 87.63,1.27 arc-90 86.36,0 1.27,0 arc-90 0,1.27 0,52.07 arc-90 1.27,53.34 86.36,53.34 arc-90
N$1
  Bottom 0.152: R1.1 IC1.36
N$3
  Bottom 0.406: NMOS.2 IC1.1
N$4
  Bottom 0.152: IC6.5 64.14,20.95 63.5,20.32 61.91,20.32 60.96,19.37 60.96,12.7 60.33,12.06 56.83,12.06 54.93,13.97 SJ3.1
PHI0
  Top 0.152: IC1.37 82.87,42.23 66.36,42.23 57.59,33.46 IC4.118
  Bottom 0.152: IC6.1 60.33,27.3 60.96,26.67 67.31,26.67 67.63,26.99 67.63,40.96 68.58,41.91 82.55,41.91 IC1.37
PHI0'
  Top 0.152: HDR1.37 85.09,41.91 66.67,41.91 58.09,33.33 IC4.117
PHI1
  Top 0.152: IC1.3 67.94,45.72 56.09,33.87 IC4.121
PHI1'
  Top 0.152: HDR1.3 70.17,44.77 67.63,44.77 56.59,33.73 IC4.120
PHI2
  Top 0.152: IC1.39 82.55,46.99 67.94,46.99 54.09,33.13 IC4.125
PHI2'
  Top 0.152: HDR1.39 84.77,46.67 68.26,46.67 54.59,33 IC4.124
R'/!W'
  Top 0.152: HDR1.34 85.09,34.29 61.59,34.29 60.59,33.29 IC4.112
R/!W
  Top 0.152: IC1.34 82.87,34.61 61.28,34.61 60.09,33.42 IC4.113
S0
  Bottom 0.152: SJ1.2 62.87,24.13 IC6.6
S1
  Bottom 0.152: SJ2.2 64.12,29.21 IC6.4
SYNC
  Top 0.152: IC1.7 HDR1.7
TCK  (via drill 0.3)
  Top 0.152: IC4.67 59.59,12.6 v59.69,12.7
  Bottom 0.152: JTAG.1 53.34,49.53 55.25,49.53 59.69,45.09 v59.69,12.7
TDI  (via drill 0.3)
  Top 0.152: IC4.63 57.59,12.58 v57.47,12.7
  Bottom 0.152: JTAG.9 57.47,35.24 v57.47,12.7
TDO  (via drill 0.3)
  Top 0.152: IC4.122 55.59,31.41 55.88,31.11 v59.05,31.11
  Bottom 0.152: JTAG.3 53.34,46.99 55.25,46.99 59.05,43.18 v59.05,31.11
TEST  (via drill 0.9)
  Top 0.152: IC4.115 59.09,33.05 61.59,35.56 v63.5,35.56
TMS  (via drill 0.3)
  Top 0.152: IC4.65 58.59,12.53 v58.42,12.7
  Bottom 0.152: v58.42,12.7 58.42,41.28 55.25,44.45 53.34,44.45 JTAG.5
VA0  (via drill 0.3)
  Top 0.152: v43.81,31.43 43.81,30.16 43.49,29.84 IC4.2
  Bottom 0.152: SV2.1 6.98,43.82 32.38,43.82 43.81,32.38 v43.81,31.43
VA1  (via drill 0.3)
  Top 0.152: v44.45,30.8 44.45,30.16 43.63,29.34 IC4.3
  Bottom 0.152: SV2.2 3.81,49.53 3.81,47.62 7.3,44.13 32.7,44.13 44.45,32.38 v44.45,30.8 44.45,31.11
VA2  (via drill 0.3)
  Top 0.152: v45.09,30.16 43.76,28.84 IC4.4
  Bottom 0.152: SV2.3 8.89,44.45 33.02,44.45 45.09,32.38 v45.09,30.16
VA3  (via drill 0.3)
  Top 0.152: v45.72,29.53 44.53,28.34 IC4.5
  Bottom 0.152: SV2.4 6.35,49.53 6.35,47.62 9.21,44.77 33.34,44.77 45.72,32.38 v45.72,29.53
VA4  (via drill 0.3)
  Top 0.152: IC4.7 46.07,27.34 v46.99,28.26
  Bottom 0.152: SV2.6 8.89,49.53 8.89,47.62 11.11,45.4 33.97,45.4 46.99,32.38 v46.99,28.26
VA5  (via drill 0.3)
  Top 0.152: v48.26,26.99 47.47,26.19 47.25,25.97 47.11,25.84 IC4.10
  Bottom 0.152: SV2.8 11.43,49.53 11.43,47.62 13.02,46.04 34.61,46.04 48.26,32.38 v48.26,26.99
VA6  (via drill 0.3)
  Top 0.152: v49.53,25.72 48.65,24.84 IC4.12
  Bottom 0.152: SV2.10 13.97,49.53 13.97,47.62 14.92,46.67 35.24,46.67 49.53,32.38 v49.53,25.72
VA7
  Top 0.152: SV2.12 16.51,49.53 16.51,47.62 20.64,43.5 34.61,43.5 45.09,33.02 IC4.143
VA8
  Top 0.152: SV2.14 19.05,49.53 19.05,47.62 22.54,44.13 35.24,44.13 46.59,32.79 IC4.140
VA9
  Top 0.152: SV2.16 21.59,49.53 21.59,47.62 24.45,44.77 35.88,44.77 47.59,33.05 IC4.138
VA10
  Top 0.152: SV2.18 24.13,49.53 24.13,47.62 26.35,45.4 36.51,45.4 48.59,33.33 IC4.136
VA11
  Top 0.152: SV2.20 26.67,49.53 26.67,47.62 28.26,46.04 37.15,46.04 49.59,33.6 IC4.134
VA12
  Top 0.152: SV2.22 29.21,49.53 29.21,47.62 30.16,46.67 37.78,46.67 50.59,33.87 IC4.132
VA13
  Top 0.152: SV2.24 31.75,49.53 36.83,49.53 52.09,34.27 IC4.129
VCC
  Top 0.406: HDR1.8 IC1.8
  Bottom 0.152: HDR1.8 73.01,33.02 R1.2
  Bottom 0.406: C3.1.1 14.29,40.64 | 14.29,40.64 IC3.32 16.51,41.91 32.08,41.91 C2.1.1 IC2.32 | 10.16,40.64 C2.1 10.16,38.1 11.43,36.83 11.43,36.35 VR1.3 | 10.16,40.66 10.16,40.64 | 10.16,40.64 14.29,40.64 | IC1.8 69.85,33.02 69.85,3.81 3.81,3.81 3.81,40.64 10.16,40.64
VD0  (via drill 0.3)
  Top 0.152: v46.36,28.89 45.3,27.84 IC4.6
  Bottom 0.152: SV2.5 10.8,45.09 33.66,45.09 46.36,32.38 v46.36,28.89
VD1  (via drill 0.3)
  Top 0.152: v47.62,27.62 46.83,26.83 46.48,26.47 46.34,26.34 IC4.9
  Bottom 0.152: SV2.7 12.7,45.72 34.29,45.72 47.62,32.38 v47.62,27.62
VD2  (via drill 0.3)
  Top 0.152: v48.89,26.35 47.88,25.34 IC4.11
  Bottom 0.152: SV2.9 14.61,46.36 34.92,46.36 48.89,32.38 v48.89,26.35
VD3  (via drill 0.3)
  Top 0.152: v50.16,25.08 49.42,24.34 IC4.13
  Bottom 0.152: SV2.11 16.51,46.99 35.56,46.99 50.16,32.38 v50.16,25.08
VD4
  Top 0.152: SV2.13 22.23,43.82 34.92,43.82 45.59,33.15 IC4.142
VD5
  Top 0.152: SV2.15 24.13,44.45 35.56,44.45 47.09,32.92 IC4.139
VD6
  Top 0.152: SV2.17 26.04,45.09 36.2,45.09 48.09,33.19 IC4.137
VD7
  Top 0.152: SV2.19 27.94,45.72 36.83,45.72 49.09,33.46 IC4.135
VD8
  Top 0.152: SV2.21 29.84,46.36 37.47,46.36 50.09,33.73 IC4.133
VD9
  Top 0.152: SV2.23 31.75,46.99 38.1,46.99 51.09,34 IC4.131
VD10
  Top 0.152: SV2.25 37.47,48.26 51.59,34.14 IC4.130
VD11
  Top 0.152: SV2.26 36.2,50.8 52.59,34.41 IC4.128